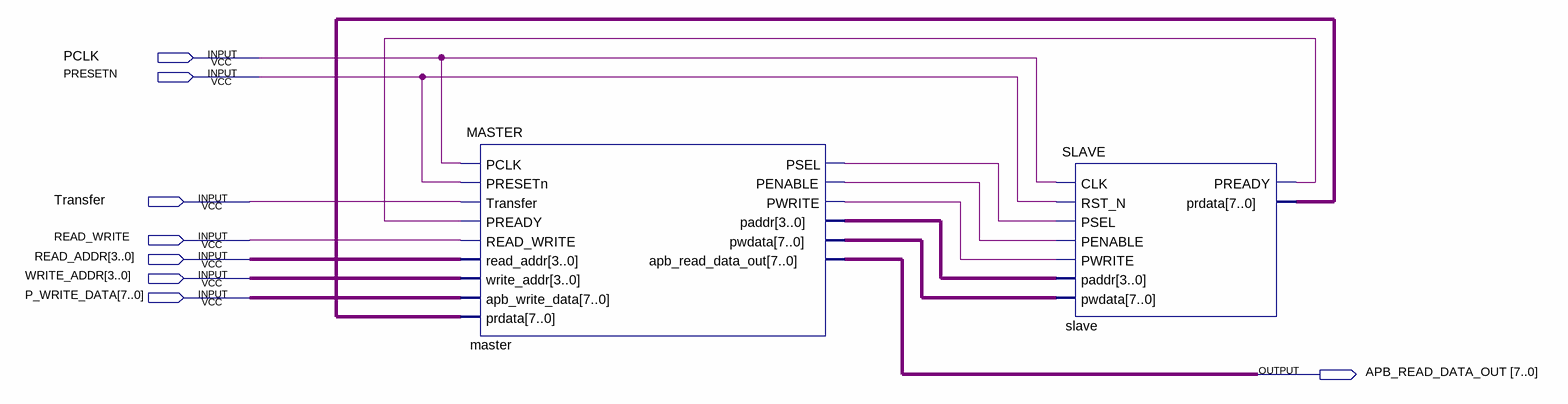
[diagram p0: schematic sheet]
// Quartus schematic APB.bdf as structural Verilog: 2 symbols, 8 pins
module APB (
  input  PCLK,
  input  PRESETN,
  input  Transfer,
  input  READ_WRITE,
  input  [3:0] READ_ADDR,
  input  [3:0] WRITE_ADDR,
  input  [7:0] P_WRITE_DATA,
  output [7:0] APB_READ_DATA_OUT
);

  wire master_penable, master_psel, master_pwrite, slave_pready;
  wire [3:0] master_paddr;
  wire [7:0] master_pwdata, slave_prdata;

  MASTER master (
    .PCLK(PCLK), .PRESETn(PRESETN), .Transfer(Transfer), .PREADY(slave_pready), .READ_WRITE(READ_WRITE),
    .read_addr(READ_ADDR), .write_addr(WRITE_ADDR), .apb_write_data(P_WRITE_DATA), .prdata(slave_prdata),
    .PSEL(master_psel), .PENABLE(master_penable), .PWRITE(master_pwrite), .paddr(master_paddr),
    .pwdata(master_pwdata), .apb_read_data_out(APB_READ_DATA_OUT));
  SLAVE slave (
    .CLK(PCLK), .RST_N(PRESETN), .PSEL(master_psel), .PENABLE(master_penable), .PWRITE(master_pwrite),
    .paddr(master_paddr), .pwdata(master_pwdata), .PREADY(slave_pready), .prdata(slave_prdata));
endmodule
